# EAGLE schematic LVDStoCMOS_DB15 (EAGLE 7.1.0)
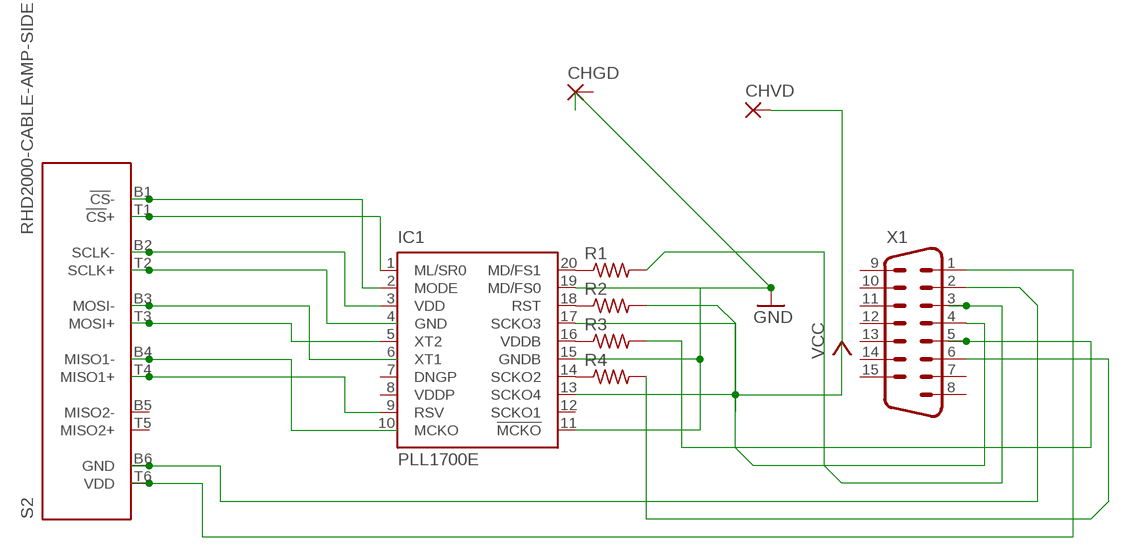
[diagram p0: schematic, sheet 1]

## Parts
CHGD  1,6/0,8  [1,6/0,8]
CHVD  1,6/0,8  [1,6/0,8]
IC1  PLL1700E  [SSOP20]
R1  R-US_R0402  [R0402]
R2  R-US_R0402  [R0402]
R3  R-US_R0402  [R0402]
R4  R-US_R0402  [R0402]
S2  RHD2000-CABLE-AMP-SIDE  [OMNETICS_PZN-12-AA]
X1  M15H  [M15H]

## Nets
GND: IC1.11(!MCKO) IC1.15(GNDB) IC1.19(MD/FS0)
N$1: IC1.20(MD/FS1) R1.1
N$2: IC1.18(RST) R2.1
N$3: IC1.16(VDDB) R3.1
N$4: IC1.14(SCKO2) R4.1
N$5: IC1.2(MODE) S2.B1(!CS!-)
N$6: CHVD.1(P) IC1.13(SCKO4) IC1.17(SCKO3)
N$7: IC1.1(ML/SR0) S2.T1(!CS!+)
N$8: IC1.3(VDD) S2.B2(SCLK-)
N$9: S2.T2(SCLK+)
N$10: S2.B3(MOSI-)
N$11: IC1.5(XT2) S2.T3(MOSI+)
N$12: IC1.9(RSV) S2.T4(MISO1+)
N$13: R1.2 X1.3
N$14: S2.B6(GND) X1.2
N$15: S2.T6(VDD) X1.1
N$17: S2.B4(MISO1-)
N$18: R2.2 X1.4
N$19: R3.2 X1.5
N$20: R4.2 X1.6
Unconnected: CHGD.1(P) IC1.6(XT1) IC1.10(MCKO) IC1.12(SCKO1) S2.B5(MISO2-) S2.T5(MISO2+) X1.7 X1.8 X1.9 X1.10 X1.11 X1.12 X1.13 X1.14 X1.15

## Power pins joined to a net without a drawn wire
DNGP: IC1.7(DNGP)
GND: IC1.4(GND)
VDDP: IC1.8(VDDP)

## Library data of the parts
CHGD CHVD = wirepad:1,6/0,8: THROUGH-HOLE PAD
IC1 = texas:PLL1700*: MULTI-CLOCK GENERATOR GENERATED AUDIO SYSTEM CLOCK Phase Lock Loop (PLL).; MF: TEXAS INSTRUMENT CONNECTORS; MPN: PLL1700E; OC_FARNELL: unknown; OC_NEWARK: 36K3452
R1-R4 = resistor:R-US_: RESISTOR, American symbol
S2 = RHD2000:RHD2000-CABLE-AMP-SIDE: Omnetics A79623 PZN-12-AA connector for SPI interface (amplifier side)
X1 = con-subd:M15: SUB-D; OC_FARNELL: unknown; OC_NEWARK: unknown